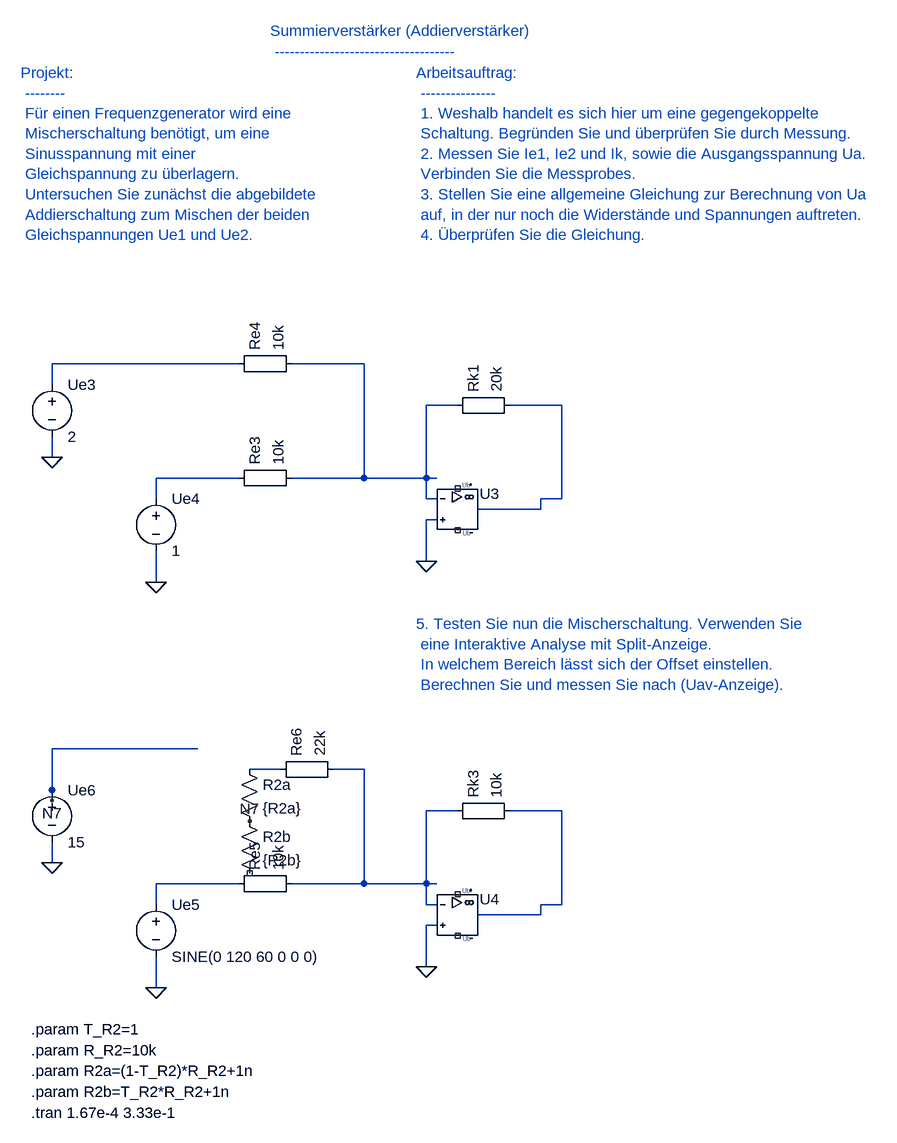
[diagram p0: schematic 1_2_4_Summierverstärker.asc]
1_2_4_Summierverstärker.asc, the LTspice schematic file:
Version 4
SHEET 1 880 680
WIRE 96 672 96 688
WIRE 688 768 672 768
WIRE 672 768 672 736
WIRE 672 736 688 736
WIRE 752 784 848 784
WIRE 848 784 848 768
WIRE 256 848 256 864
WIRE 256 1472 256 1488
WIRE 96 1296 96 1312
WIRE 688 1392 672 1392
WIRE 672 1392 672 1360
WIRE 672 1360 688 1360
WIRE 752 1408 848 1408
WIRE 848 1408 848 1392
WIRE 96 704 96 688
WIRE 672 864 672 800
WIRE 672 800 688 800
WIRE 800 624 880 624
WIRE 880 624 880 768
WIRE 880 768 848 768
WIRE 672 736 672 624
WIRE 672 624 720 624
WIRE 576 736 672 736
WIRE 464 736 576 736
WIRE 464 560 576 560
WIRE 576 560 576 736
WIRE 96 592 96 560
WIRE 96 560 384 560
WIRE 256 896 256 864
WIRE 256 768 256 736
WIRE 256 736 384 736
WIRE 96 1328 96 1312
WIRE 672 1488 672 1424
WIRE 672 1424 688 1424
WIRE 800 1248 880 1248
WIRE 880 1248 880 1392
WIRE 880 1392 848 1392
WIRE 672 1360 672 1248
WIRE 672 1248 720 1248
WIRE 576 1360 672 1360
WIRE 464 1360 576 1360
WIRE 528 1184 576 1184
WIRE 576 1184 576 1360
WIRE 256 1520 256 1488
WIRE 256 1392 256 1360
WIRE 256 1360 384 1360
WIRE 400 1184 448 1184
WIRE 320 1152 96 1152
WIRE 96 1152 96 1216
WIRE 96 1216 96 1232
FLAG 96 704 0
FLAG 672 864 0
FLAG 256 896 0
FLAG 96 1328 0
FLAG 672 1488 0
FLAG 256 1520 0
FLAG 96 704 0
FLAG 672 864 0
FLAG 256 896 0
FLAG 96 1328 0
FLAG 672 1488 0
FLAG 256 1520 0
FLAG 400 1264 N7
FLAG 96 1232 N7
SYMBOL voltage 96 576 R0
SYMATTR InstName Ue3
SYMATTR Value 2
SYMBOL Misc\EuropeanResistor 368 752 R270
SYMATTR InstName Re3
SYMATTR Value 10k
SYMBOL Misc\EuropeanResistor 368 576 R270
SYMATTR InstName Re4
SYMATTR Value 10k
SYMBOL UniversalOpAmp2 720 784 R0
SYMATTR InstName U3
SYMATTR Value UniversalOpAmp2
SYMBOL Misc\EuropeanResistor 704 640 R270
SYMATTR InstName Rk1
SYMATTR Value 20k
SYMBOL voltage 256 752 R0
SYMATTR InstName Ue4
SYMATTR Value 1
SYMBOL voltage 256 1376 R0
SYMATTR InstName Ue5
SYMATTR Value SINE(0 120 60 0 0 0)
SYMBOL voltage 96 1200 R0
SYMATTR InstName Ue6
SYMATTR Value 15
SYMBOL Misc\EuropeanResistor 368 1376 R270
SYMATTR InstName Re5
SYMATTR Value 10k
SYMBOL Misc\EuropeanResistor 432 1200 R270
SYMATTR InstName Re6
SYMATTR Value 22k
SYMBOL UniversalOpAmp2 720 1408 R0
SYMATTR InstName U4
SYMATTR Value UniversalOpAmp2
SYMBOL Misc\EuropeanResistor 704 1264 R270
SYMATTR InstName Rk3
SYMATTR Value 10k
SYMBOL res 384 1168 R0
SYMATTR InstName R2a
SYMATTR Value {R2a}
SYMBOL res 384 1248 R0
SYMATTR InstName R2b
SYMATTR Value {R2b}
TEXT 64 1584 Left 2 !.param T_R2=1
TEXT 64 1616 Left 2 !.param R_R2=10k
TEXT 64 1648 Left 2 !.param R2a=(1-T_R2)*R_R2+1n
TEXT 64 1680 Left 2 !.param R2b=T_R2*R_R2+1n
TEXT 64 1712 Left 2 !.tran 1.67e-4 3.33e-1
TEXT 432 48 Left 2 ;Summierverstärker (Addierverstärker) \n ------------------------------------
TEXT 656 112 Left 2 ;Arbeitsauftrag: \n --------------- \n 1. Weshalb handelt es sich hier um eine gegengekoppelte \n Schaltung. Begründen Sie und überprüfen Sie durch Messung. \n 2. Messen Sie Ie1, Ie2 und Ik, sowie die Ausgangsspannung Ua. \n Verbinden Sie die Messprobes. \n 3. Stellen Sie eine allgemeine Gleichung zur Berechnung von Ua \n auf, in der nur noch die Widerstände und Spannungen auftreten. \n 4. Überprüfen Sie die Gleichung.
TEXT 48 112 Left 2 ;Projekt: \n -------- \n Für einen Frequenzgenerator wird eine \n Mischerschaltung benötigt, um eine \n Sinusspannung mit einer \n Gleichspannung zu überlagern. \n Untersuchen Sie zunächst die abgebildete \n Addierschaltung zum Mischen der beiden \n Gleichspannungen Ue1 und Ue2.
TEXT 656 960 Left 2 ;5. Testen Sie nun die Mischerschaltung. Verwenden Sie \n eine Interaktive Analyse mit Split-Anzeige. \n In welchem Bereich lässt sich der Offset einstellen. \n Berechnen Sie und messen Sie nach (Uav-Anzeige).

The netlist it stands for:
* 1_2_4_Summierverstärker.asc
V§Ue3 N005 0 2
Re3 N006 N001 10k
Re4 N005 N001 10k
XU3 0 N001 NC_01 NC_02 N002 level2 UniversalOpAmp2 Avol=1Meg GBW=10Meg Slew=10Meg Ilimit=25m Rail=0 Vos=0 En=0 Enk=0 In=0 Ink=0 Rin=500Meg  ; pins In+ In- V+ V- OUT
Rk1 N001 N002 20k
V§Ue4 N006 0 1
V§Ue5 N007 0 SINE(0 120 60 0 0 0)
V§Ue6 N7 0 15
Re5 N007 N003 10k
Re6 N008 N003 22k
XU4 0 N003 NC_03 NC_04 N004 level2 UniversalOpAmp2 Avol=1Meg GBW=10Meg Slew=10Meg Ilimit=25m Rail=0 Vos=0 En=0 Enk=0 In=0 Ink=0 Rin=500Meg  ; pins In+ In- V+ V- OUT
Rk3 N003 N004 10k
R2a N008 N7 {R2a}
R2b N7 NC_05 {R2b}
.param T_R2=1
.param R_R2=10k
.param R2a=(1-T_R2)*R_R2+1n
.param R2b=T_R2*R_R2+1n
.tran 1.67e-4 3.33e-1
* Summierverstärker (Addierverstärker)
*  ------------------------------------
* Arbeitsauftrag:
*  ---------------
*  1. Weshalb handelt es sich hier um eine gegengekoppelte
*  Schaltung. Begründen Sie und überprüfen Sie durch Messung.
*  2. Messen Sie Ie1, Ie2 und Ik, sowie die Ausgangsspannung Ua.
*  Verbinden Sie die Messprobes.
*  3. Stellen Sie eine allgemeine Gleichung zur Berechnung von Ua
*  auf, in der nur noch die Widerstände und Spannungen auftreten.
*  4. Überprüfen Sie die Gleichung.
* Projekt:
*  --------
*  Für einen Frequenzgenerator wird eine
*  Mischerschaltung benötigt, um eine
*  Sinusspannung mit einer
*  Gleichspannung zu überlagern.
*  Untersuchen Sie zunächst die abgebildete
*  Addierschaltung zum Mischen der beiden
*  Gleichspannungen Ue1 und Ue2.
* 5. Testen Sie nun die Mischerschaltung. Verwenden Sie
*  eine Interaktive Analyse mit Split-Anzeige.
*  In welchem Bereich lässt sich der Offset einstellen.
*  Berechnen Sie und messen Sie nach (Uav-Anzeige).
.lib UniversalOpAmp2.lib
.backanno
.end